# Altium schematic sheet USB_DBG.SchDoc
size A4; SheetNumber: 12; SheetTotal: 12
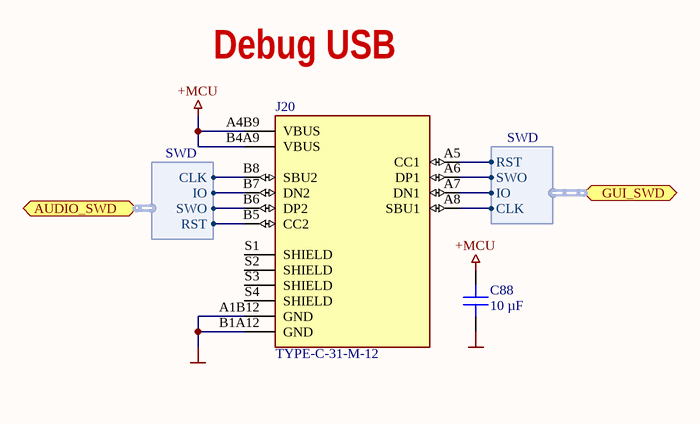
[diagram p0: USB_DBG.SchDoc]

## Parts
C88  10 µF  [CAP 0805_2012]
J20  TYPE-C-31-M-12  [HRO_TYPE-C-31-M-12 - REZONIT]

## Ports
AUDIO_SWD (bidir, harness SWD), GUI_SWD (bidir, harness SWD)

## Harnesses
SWD: CLK, IO, SWO, RST

## Nets
+MCU: C88.2 J20.A4B9(VBUS) J20.B4A9(VBUS)
GND: C88.1 J20.A1B12(GND) J20.B1A12(GND)
NetJ20_A5: J20.A5(CC1) ; port GUI_SWD.RST
NetJ20_A6: J20.A6(DP1) ; port GUI_SWD.SWO
NetJ20_A7: J20.A7(DN1) ; port GUI_SWD.IO
NetJ20_A8: J20.A8(SBU1) ; port GUI_SWD.CLK
NetJ20_B5: J20.B5(CC2) ; port AUDIO_SWD.RST
NetJ20_B6: J20.B6(DP2) ; port AUDIO_SWD.SWO
NetJ20_B7: J20.B7(DN2) ; port AUDIO_SWD.IO
NetJ20_B8: J20.B8(SBU2) ; port AUDIO_SWD.CLK

Not connected (* = marked no-connect by the designer): J20 S1(SHIELD) S2(SHIELD) S3(SHIELD) S4(SHIELD)

## Notes on the sheet
- Debug USB

## Library data of the parts
C88 = C0805C106K8PAC7800: CAP CER 10UF 10V X5R 0805; manufacturer: KEMET; Tolerance: ±10%; Part Number: C0805C106K8PAC7800; Value: 10 µF; Applications: Bypass, Decoupling; Capacitance: 10 µF; componentlink1description: Datasheet; componentlink1url: https://connect.kemet.com:7667/gateway/IntelliData-ComponentDocumentation/1.0/download/datasheet/C0805C106K8PACTU; componentlink2description: DigiKey Link; componentlink2url: https://www.digikey.com/en/products/detail/kemet/C0805C106K8PAC7800/1090830; Device Package: 0805 (2012 Metric); lastupdated: 9/14/2022 7:51:56 AM; Lifecycle Status: Active; Minimum Order: 1; Mounting Type: Surface Mount, MLCC; Operating Temperature: -55°C ~ 85°C; Package / Case: 0805 (2012 Metric); packaging: TapeAndReel; partid: 44790; Part Status: Active; price: 0.02; series: SMD Comm X5R; Size / Dimension: 0.079" L x 0.049" W (2.00mm x 1.25mm); Supplier 1: DigiKey; Supplier Part Number 1: 399-C0805C106K8PAC7800CT-ND; Temperature Coefficient: X5R; Thickness (Max): 0.055" (1.40mm); Voltage - Rated: 10V
J20 = TYPE-C-31-M-12: USB Connectors 24 Receptacle 1 8.94*7.3mm RoHS; MF: {'manufacturer': u'HRO Electronics Co., Ltd.'}; Package: None; Price: None; Value: *; MP: TYPE-C-31-M-12; Availability: Unavailable